# Altium project Remoter.PrjPCB
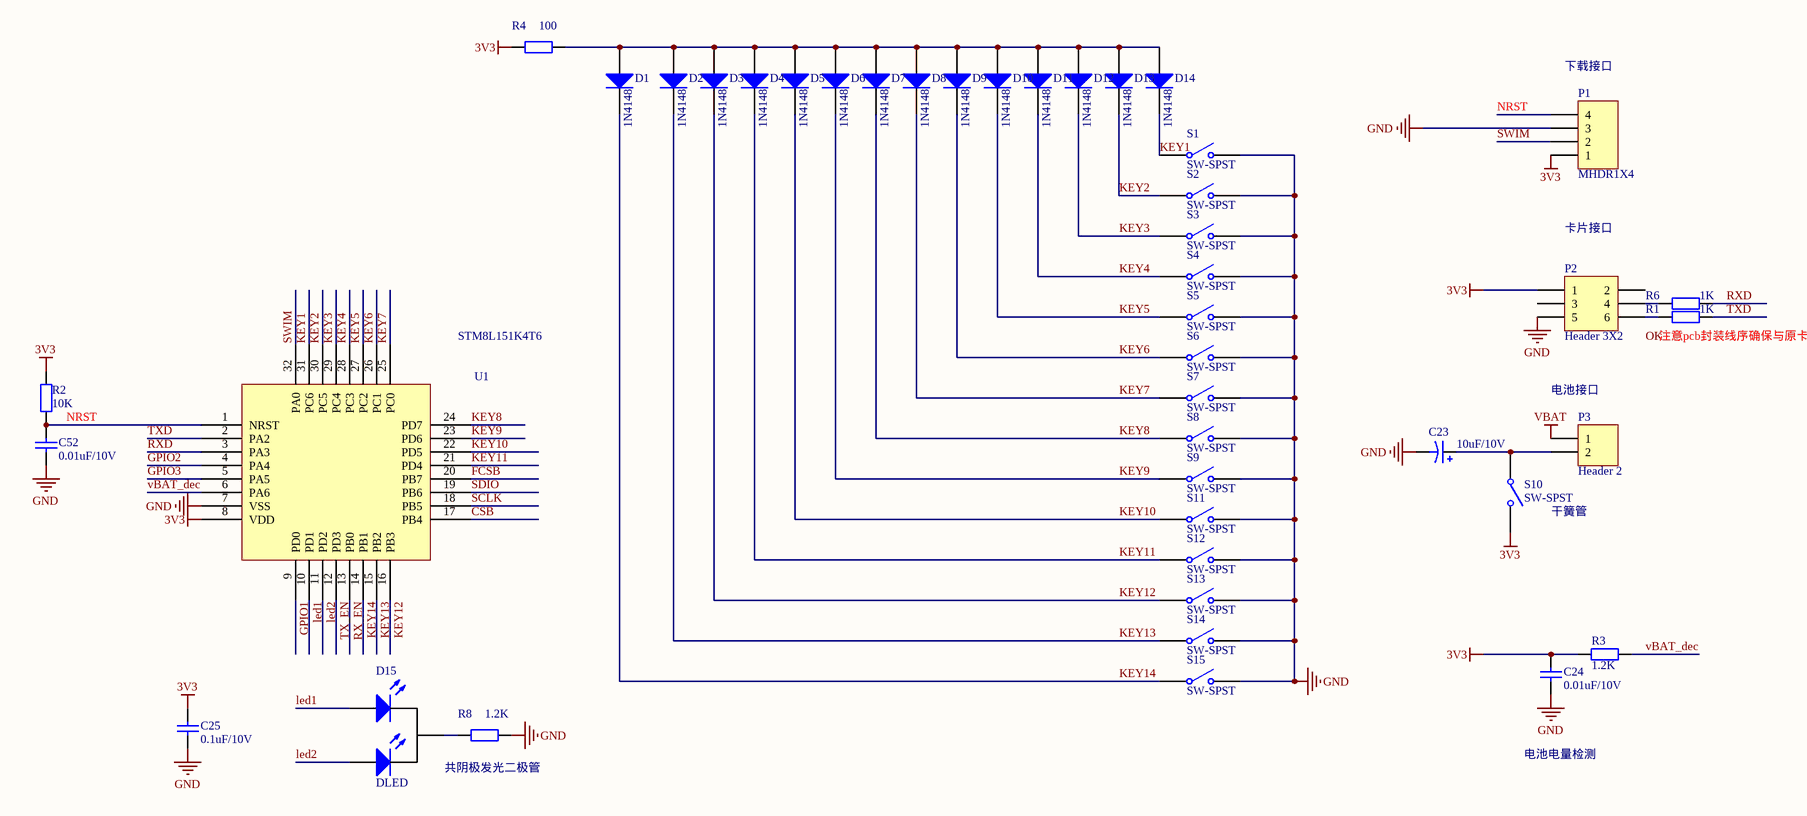
[diagram p0: mcu.SchDoc]
2 sheets, 84 parts. Net scope: global (net labels, ports and power ports of the same name join across sheets).
Sheets:
  mcu.SchDoc
  RF.SchDoc

## Sheet mcu.SchDoc
size A3

### Parts
(Parts that share a designator on the sheet are numbered #1, #2 ... from top to bottom, then left to right.)
C23#1  10uF/10V
C24  0.01uF/10V  [0603C]
C25  0.1uF/10V  [0603C]
C52  0.01uF/10V  [0603C]
D1  1N4148
D2  1N4148
D3  1N4148
D4  1N4148
D5  1N4148
D6  1N4148
D7  1N4148
D8  1N4148
D9  1N4148
D10  1N4148
D11  1N4148
D12  1N4148
D13  1N4148
D14  1N4148
D15  DLED
P1  MHDR1X4  [SIP4]
P2  Header 3X2
P3  Header 2
R1#1  1K  [0603R]
R2  10K  [0603R]
R3  1.2K  [0603R]
R4  100  [0603R]
R6  1K  [0603R]
R8  1.2K  [0603R]
S1  SW-SPST
S2  SW-SPST
S3  SW-SPST
S4  SW-SPST
S5  SW-SPST
S6  SW-SPST
S7  SW-SPST
S8  SW-SPST
S9  SW-SPST
S10  SW-SPST
S11  SW-SPST
S12  SW-SPST
S13  SW-SPST
S14  SW-SPST
S15  SW-SPST
U1  STM8L151K4T6  [QFP80P900X900X245-32N]

### Nets
3V3: C24.1 C25.1 P1.1 P2.1 R2.2 R3.2 R4.2 S10.2(NO) U1.8(VDD)
GND: C23#1.2 C24.2 C25.2 C52.2 P1.3 P2.5 R8.1 S1.2(NO) S2.2(NO) S3.2(NO) S4.2(NO) S5.2(NO) S6.2(NO) S7.2(NO) S8.2(NO) S9.2(NO) S11.2(NO) S12.2(NO) S13.2(NO) S14.2(NO) S15.2(NO) U1.7(VSS)
VBAT: P3.1
CSB: U1.17(PB4)
FCSB: U1.20(PB7)
GPIO1: U1.9(PD0)
GPIO2: U1.4(PA4)
GPIO3: U1.5(PA5)
KEY1: D14.2(K) S1.1(COMMON) U1.31(PC6)
KEY2: D13.2(K) S2.1(COMMON) U1.30(PC5)
KEY3: D12.2(K) S3.1(COMMON) U1.29(PC4)
KEY4: D11.2(K) S4.1(COMMON) U1.28(PC3)
KEY5: D10.2(K) S5.1(COMMON) U1.27(PC2)
KEY6: D9.2(K) S6.1(COMMON) U1.26(PC1)
KEY7: D8.2(K) S7.1(COMMON) U1.25(PC0)
KEY8: D7.2(K) S8.1(COMMON) U1.24(PD7)
KEY9: D6.2(K) S9.1(COMMON) U1.23(PD6)
KEY10: D5.2(K) S11.1(COMMON) U1.22(PD5)
KEY11: D4.2(K) S12.1(COMMON) U1.21(PD4)
KEY12: D3.2(K) S13.1(COMMON) U1.16(PB3)
KEY13: D2.2(K) S14.1(COMMON) U1.15(PB2)
KEY14: D1.2(K) S15.1(COMMON) U1.14(PB1)
led1: D15.1(A) U1.10(PD1)
led2: D15.3(A) U1.11(PD2)
NRST: C52.1 P1.4 R2.1 U1.1(NRST)
RX_EN: U1.13(PB0)
RXD: R6.1 U1.3(PA3)
SCLK: U1.18(PB5)
SDIO: U1.19(PB6)
SWIM: P1.2 U1.32(PA0)
TX_EN: U1.12(PD3)
TXD: R1#1.1 U1.2(PA2)
vBAT_dec: R3.1 U1.6(PA6)
NetC23#1_1: C23#1.1 P3.2 S10.1(COMMON)
NetD1_1: D1.1(A) D2.1(A) D3.1(A) D4.1(A) D5.1(A) D6.1(A) D7.1(A) D8.1(A) D9.1(A) D10.1(A) D11.1(A) D12.1(A) D13.1(A) D14.1(A) R4.1
NetD15_2: D15.2(K) R8.2
NetP2_4: P2.4 R6.2
NetP2_6: P2.6 R1#1.2

Not connected (* = marked no-connect by the designer): P2 2 3

### Notes on the sheet
- (near P1) 下载接口
- 卡片接口
- (near R1#1) 注意pcb封装线序确保与原卡片接口一致
- (near P3) 电池接口
- 干簧管
- 共阴极发光二极管
- 电池电量检测
- Labels drawn without touching a wire or pin: OK

### Library data of the parts
C23#1 = Cap Pol1: Polarized Capacitor (Radial); Value: 100pF; Published: 8-Jun-2000; LatestRevisionDate: 17-Jul-2002; LatestRevisionNote: Re-released for DXP Platform.; PackageReference: RB7.6-15; Publisher: Altium Limited
C24 C25 C52 = Cap: Capacitor; Value: 106; Published: 8-Jun-2000; LatestRevisionDate: 17-Jul-2002; LatestRevisionNote: Re-released for DXP Platform.; PackageReference: RAD-0.3; Publisher: Altium Limited
D1-D14 = Diode: Default Diode; Published: 8-Jun-2000; LatestRevisionDate: 17-Jul-2002; LatestRevisionNote: Re-released for DXP Platform.; PackageVersion: Sep-1996; PackageReference: SMC; Publisher: Altium Limited; Code_JEDEC: DO-214-AB
P1 = MHDR1X4: Header, 4-Pin; LatestRevisionDate: 17-Jul-2002; LatestRevisionNote: Re-released for DXP Platform.; Publisher: Altium Limited
P2 = Header 3X2: Header, 3-Pin, Dual row; LatestRevisionDate: 17-Jul-2002; LatestRevisionNote: Re-released for DXP Platform.; Publisher: Altium Limited
P3 = Header 2: Header, 2-Pin; LatestRevisionDate: 17-Jul-2002; LatestRevisionNote: Re-released for DXP Platform.; Publisher: Altium Limited
R1#1 R2-R4 R6 R8 = Res2: Resistor; Value: 10K/5%/1/8W; Published: 8-Jun-2000; LatestRevisionDate: 17-Jul-2002; LatestRevisionNote: Re-released for DXP Platform.; PackageReference: AXIAL-0.4; Publisher: Altium Limited
S1-S15 = SW-SPST: Single-Pole, Single-Throw Switch; Published: 24-Mar-1999; LatestRevisionDate: 17-Jul-2002; LatestRevisionNote: Re-released for DXP Platform.; PackageReference: SPST-2; Publisher: Altium Limited

## Sheet RF.SchDoc
size A3
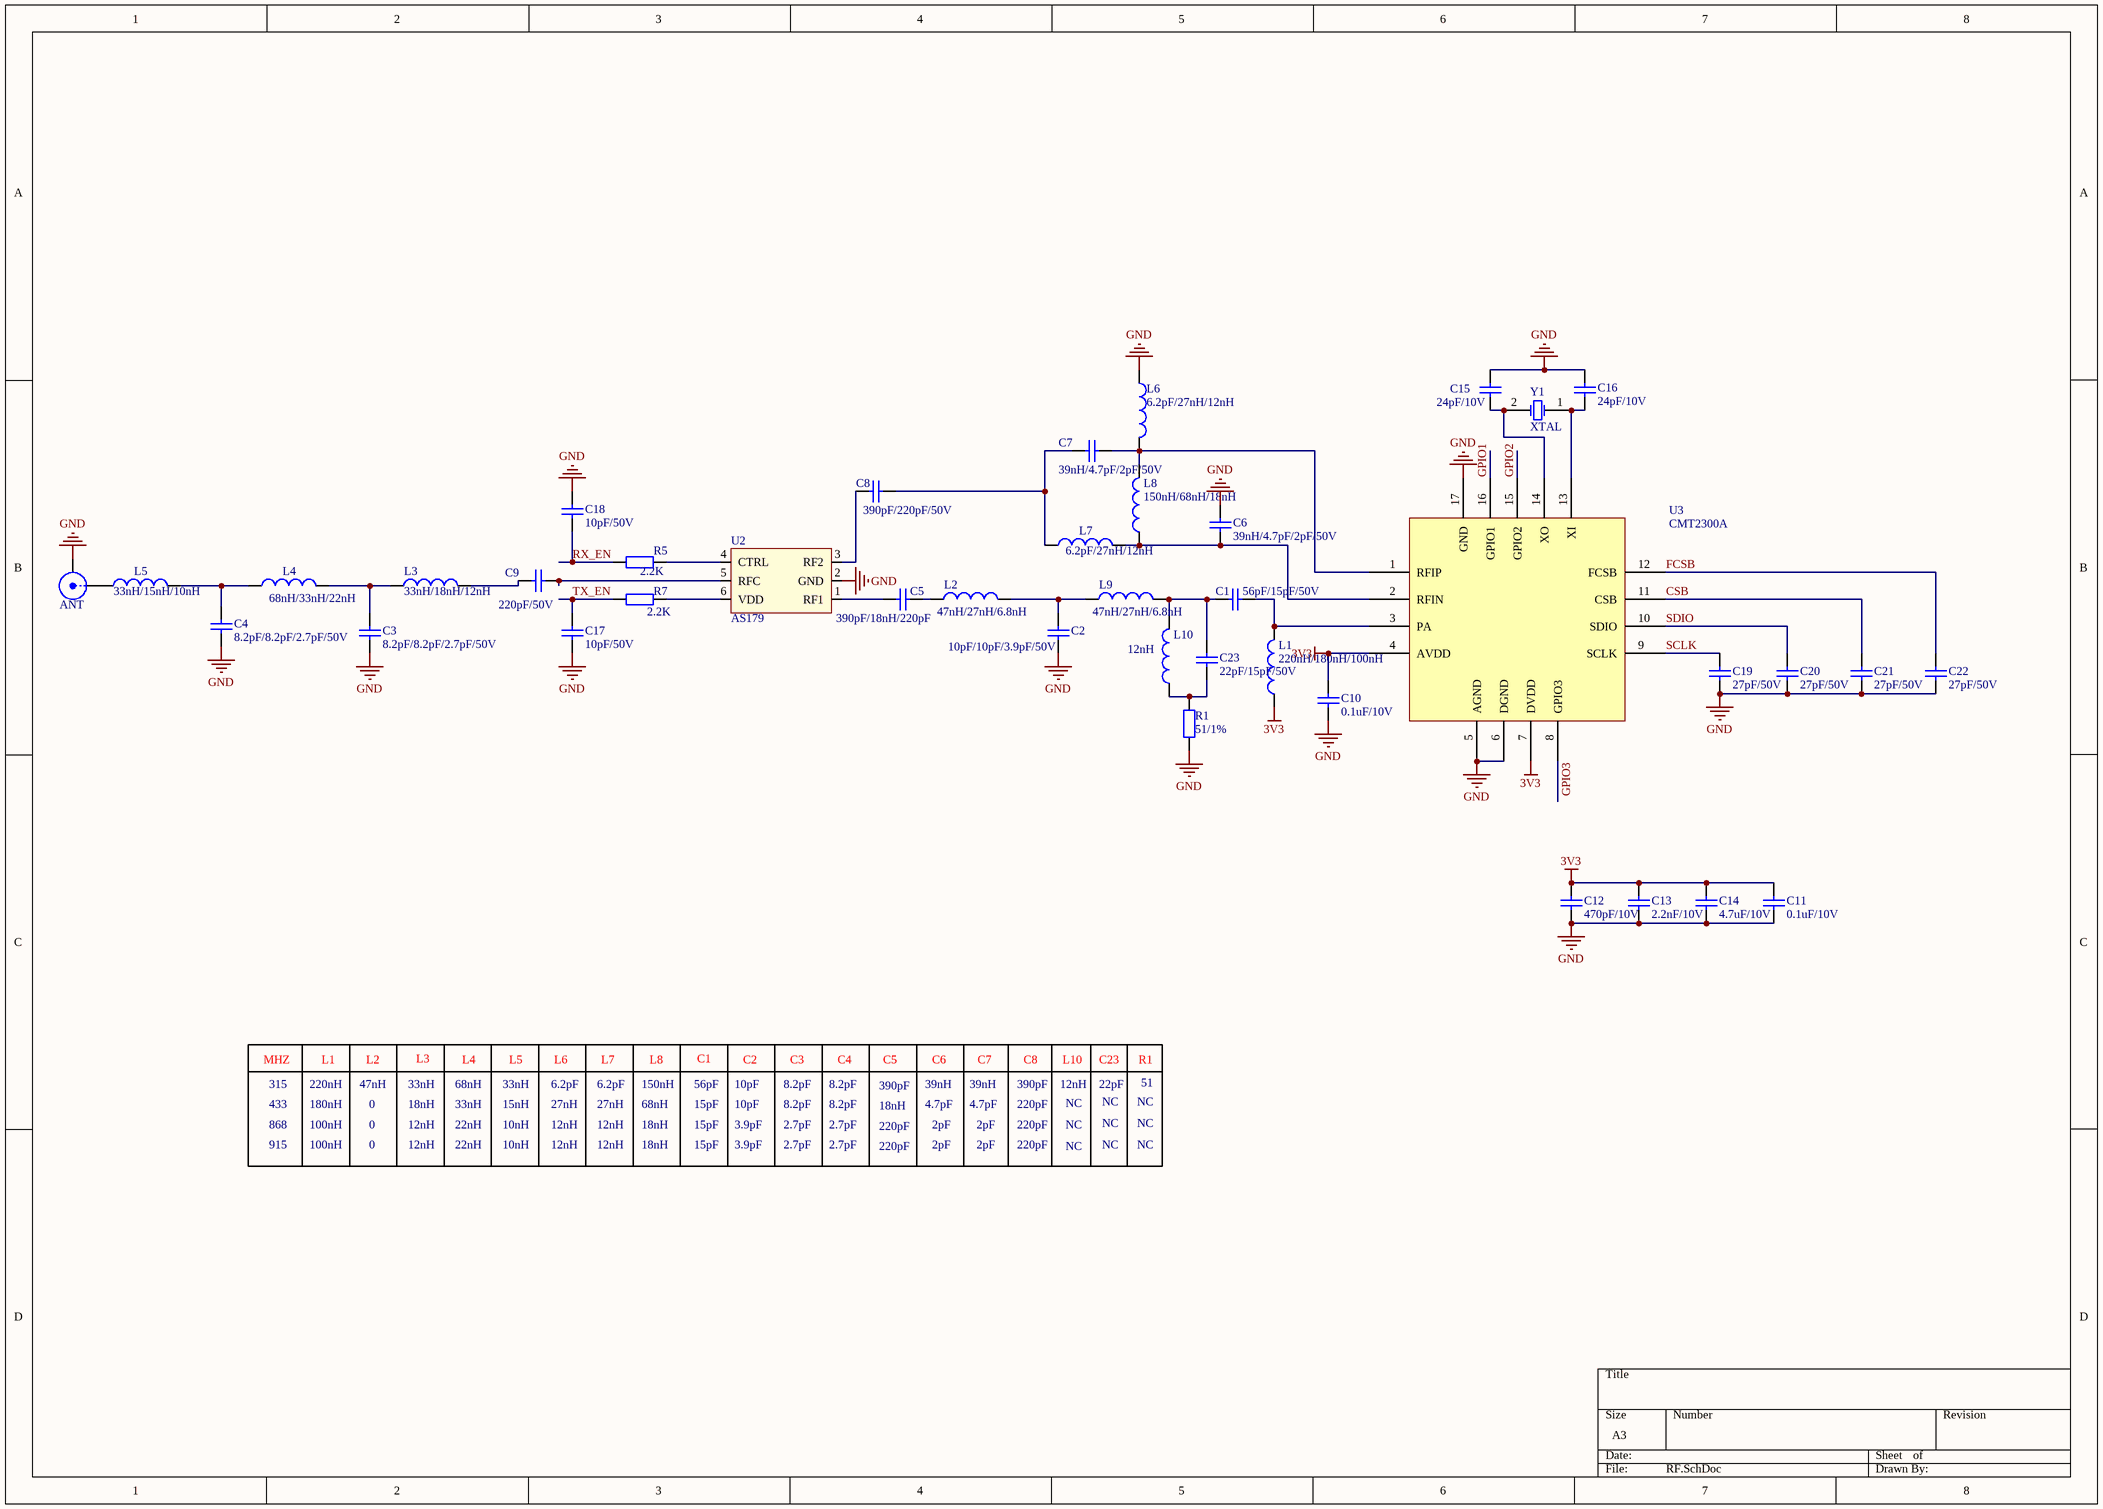
[diagram p1: RF.SchDoc]

### Parts
(Parts that share a designator on the sheet are numbered #1, #2 ... from top to bottom, then left to right.)
ANT  (no value)  [SMA Straight SMD]
C1  56pF/15pF/50V  [0603C]
C2  10pF/10pF/3.9pF/50V  [0603C]
C3  8.2pF/8.2pF/2.7pF/50V  [0603C]
C4  8.2pF/8.2pF/2.7pF/50V  [0603C]
C5  390pF/18nH/220pF  [0603C]
C6  39nH/4.7pF/2pF/50V  [0603C]
C7  39nH/4.7pF/2pF/50V  [0603C]
C8  390pF/220pF/50V  [0603C]
C9  220pF/50V  [0603C]
C10  0.1uF/10V  [0603C]
C11  0.1uF/10V  [0603C]
C12  470pF/10V  [0603C]
C13  2.2nF/10V  [0603C]
C14  4.7uF/10V  [0603C]
C15  24pF/10V  [0603C]
C16  24pF/10V  [0603C]
C17  10pF/50V  [0603C]
C18  10pF/50V  [0603C]
C19  27pF/50V  [0603C]
C20  27pF/50V  [0603C]
C21  27pF/50V  [0603C]
C22  27pF/50V  [0603C]
C23#2  22pF/15pF/50V  [0603C]
L1  220nH/180nH/100nH  [0603R]
L2  47nH/27nH/6.8nH  [0603R]
L3  33nH/18nH/12nH  [0603R]
L4  68nH/33nH/22nH  [0603R]
L5  33nH/15nH/10nH  [0603R]
L6  6.2pF/27nH/12nH  [0603R]
L7  6.2pF/27nH/12nH  [0603R]
L8  150nH/68nH/18nH  [0603R]
L9  47nH/27nH/6.8nH  [0603R]
L10  12nH  [0603R]
R1#2  51/1%  [0603R]
R5  2.2K  [0603R]
R7  2.2K  [0603R]
U2  AS179
U3  CMT2300A
Y1  XTAL  [BCY-W2/D3.1]

### Nets
3V3: C10.1 C11.1 C12.1 C13.1 C14.1 L1.1 U3.4(AVDD) U3.7(DVDD)
GND: ANT.2(GND) C2.1 C3.2 C4.2 C6.2 C10.2 C11.2 C12.2 C13.2 C14.2 C15.1 C16.1 C17.1 C18.2 C19.2 C20.2 C21.2 C22.2 L6.1 R1#2.2 U2.2(GND) U3.5(AGND) U3.6(DGND) U3.17(GND)
CSB: C21.1 U3.11(CSB)
FCSB: C22.1 U3.12(FCSB)
GPIO1: U3.16(GPIO1)
GPIO2: U3.15(GPIO2)
GPIO3: U3.8(GPIO3)
RX_EN: C18.1 R5.2
SCLK: C19.1 U3.9(SCLK)
SDIO: C20.1 U3.10(SDIO)
TX_EN: C17.2 R7.2
NetANT_1: ANT.1(Signal) L5.1
NetC1_1: C1.1 C23#2.2 L9.2 L10.2
NetC1_2: C1.2 L1.2 U3.3(PA)
NetC2_2: C2.2 L2.2 L9.1
NetC3_1: C3.1 L3.1 L4.2
NetC4_1: C4.1 L4.1 L5.2
NetC5_1: C5.1 U2.1(RF1)
NetC5_2: C5.2 L2.1
NetC6_1: C6.1 L7.2 L8.1 U3.2(RFIN)
NetC7_1: C7.1 C8.2 L7.1
NetC7_2: C7.2 L6.2 L8.2 U3.1(RFIP)
NetC8_1: C8.1 U2.3(RF2)
NetC9_1: C9.1 U2.5(RFC)
NetC9_2: C9.2 L3.2
NetC15_2: C15.2 U3.14(XO) Y1.2(OSC2)
NetC16_2: C16.2 U3.13(XI) Y1.1(OSC1)
NetC23#2_1: C23#2.1 L10.1 R1#2.1
NetR5_1: R5.1 U2.4(CTRL)
NetR7_1: R7.1 U2.6(VDD)

### Notes on the sheet
- MHZ
- 315
- 433
- 868
- 220nH
- 180nH
- 100nH
- L1
- 47nH
- L2
- 0
- 33nH
- 18nH
- 12nH
- L3
- 68nH
- 22nH
- L4
- 15nH
- 10nH
- L5
- 6.2pF
- 27nH
- L6
- L7
- 150nH
- L8
- 56pF
- 15pF
- C1
- 10pF
- 3.9pF
- C2
- 8.2pF
- 2.7pF
- C3
- C4
- 390pF
- C5
- 39nH
- 4.7pF
- C6
- 2pF
- C7
- 220pF
- C8
- L10
- NC
- C23
- 22pF
- R1
- 51
- 915

### Library data of the parts
ANT = SMA: SMA Straight Connector; LatestRevisionDate: 05-oct-2007  -  Semtech; LatestRevisionNote: Re-released for DXP Platform.; Publisher: Altium Limited
C1-C22 C23#2 = Cap: Capacitor; Value: 106; Published: 8-Jun-2000; LatestRevisionDate: 17-Jul-2002; LatestRevisionNote: Re-released for DXP Platform.; PackageReference: RAD-0.3; Publisher: Altium Limited
L1-L10 = Inductor: Code_IEC: 1005; Value: 10mH; Published: 8-Jun-2000; LatestRevisionDate: 29-May-2009; LatestRevisionNote: IPC-7351 Footprint Added.; PackageReference: 0402-A; Publisher: Altium Limited; PackageDescription: Chip Inductor; Code_JEITA: 0402
R1#2 R5 R7 = Res2: Resistor; Value: 10K/5%/1/8W; Published: 8-Jun-2000; LatestRevisionDate: 17-Jul-2002; LatestRevisionNote: Re-released for DXP Platform.; PackageReference: AXIAL-0.4; Publisher: Altium Limited
U2 = PE4259 RF Switch: PE4259 Peregrine RF Switch; LatestRevisionDate: 03-Sep-2012 -  Semtech; Value: PE4259
Y1 = XTAL: Crystal Oscillator; Published: 8-Jun-2000; LatestRevisionDate: 17-Jul-2002; LatestRevisionNote: Re-released for DXP Platform.; PackageReference: R38; Publisher: Altium Limited

## Nets that join several sheets
3V3: mcu (9 pins), RF (8 pins)
GND: mcu (22 pins), RF (24 pins)
CSB: mcu (U1.17), RF (C21.1 U3.11)
FCSB: mcu (U1.20), RF (C22.1 U3.12)
GPIO1: mcu (U1.9), RF (U3.16)
GPIO2: mcu (U1.4), RF (U3.15)
GPIO3: mcu (U1.5), RF (U3.8)
RX_EN: mcu (U1.13), RF (C18.1 R5.2)
SCLK: mcu (U1.18), RF (C19.1 U3.9)
SDIO: mcu (U1.19), RF (C20.1 U3.10)
TX_EN: mcu (U1.12), RF (C17.2 R7.2)